# EAGLE schematic pa_only_1800 (EAGLE 6.2)

## Sheet 1 of 4
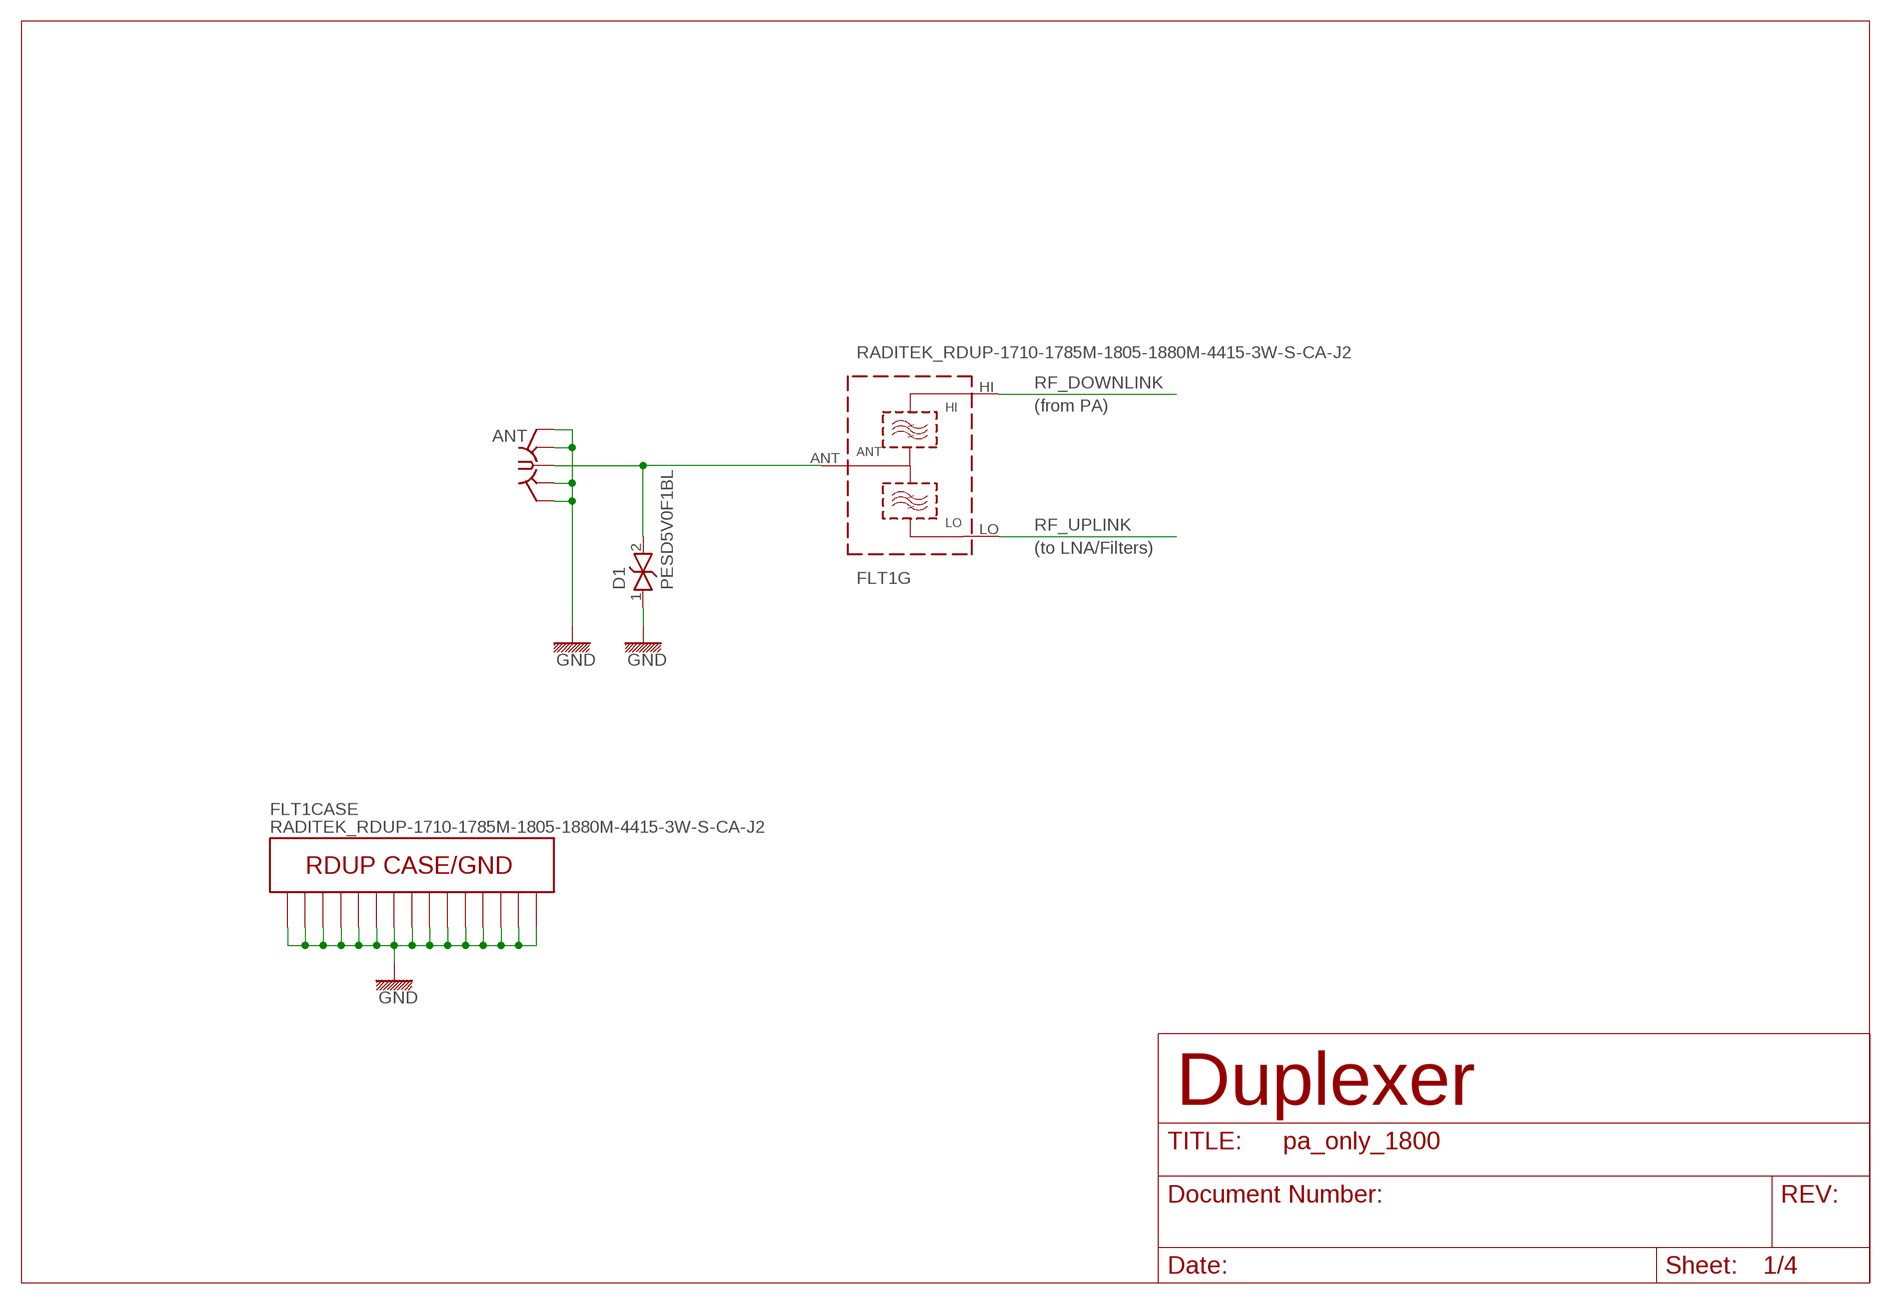
[diagram p0: schematic, sheet 1]

### Parts
ANT  SMA-F-S-TH  [SMA-F-S-TH]
D1  PESD5V0F1BL  D_ESD_SOD882  [SOD882]
FLT1  RADITEK_RDUP-1710-1785M-1805-1880M-4415-3W-S-CA-J2  [RADITEK_RDUP_4415]

### Nets
GND: ANT.G1(GND) ANT.G2(GND) ANT.G3(GND) ANT.G4(GND) D1.1 FLT1.GND@1(CASE:GND) FLT1.GND@2(CASE:GND) FLT1.GND@3(CASE:GND) FLT1.GND@4(CASE:GND) FLT1.GND@5(CASE:GND) FLT1.GND@6(CASE:GND) FLT1.GND@7(CASE:GND) FLT1.GND@8(CASE:GND) FLT1.GND@9(CASE:GND) FLT1.GND@10(CASE:GND) FLT1.GND@11(CASE:GND) FLT1.GND@12(CASE:GND) FLT1.GND@13(CASE:GND) FLT1.GND@14(CASE:GND) FLT1.GND@15(CASE:GND) ; also sheet 2,3,4
RF_ANT: ANT.C D1.2 FLT1.ANT(G:ANT)
RF_DOWNLINK: FLT1.HI(G:HI) ; also sheet 3
RF_UPLINK: FLT1.LO(G:LO) ; also sheet 2

### Notes on the sheet
- (from PA)
- (to LNA/Filters)
- Duplexer

## Sheet 2 of 4
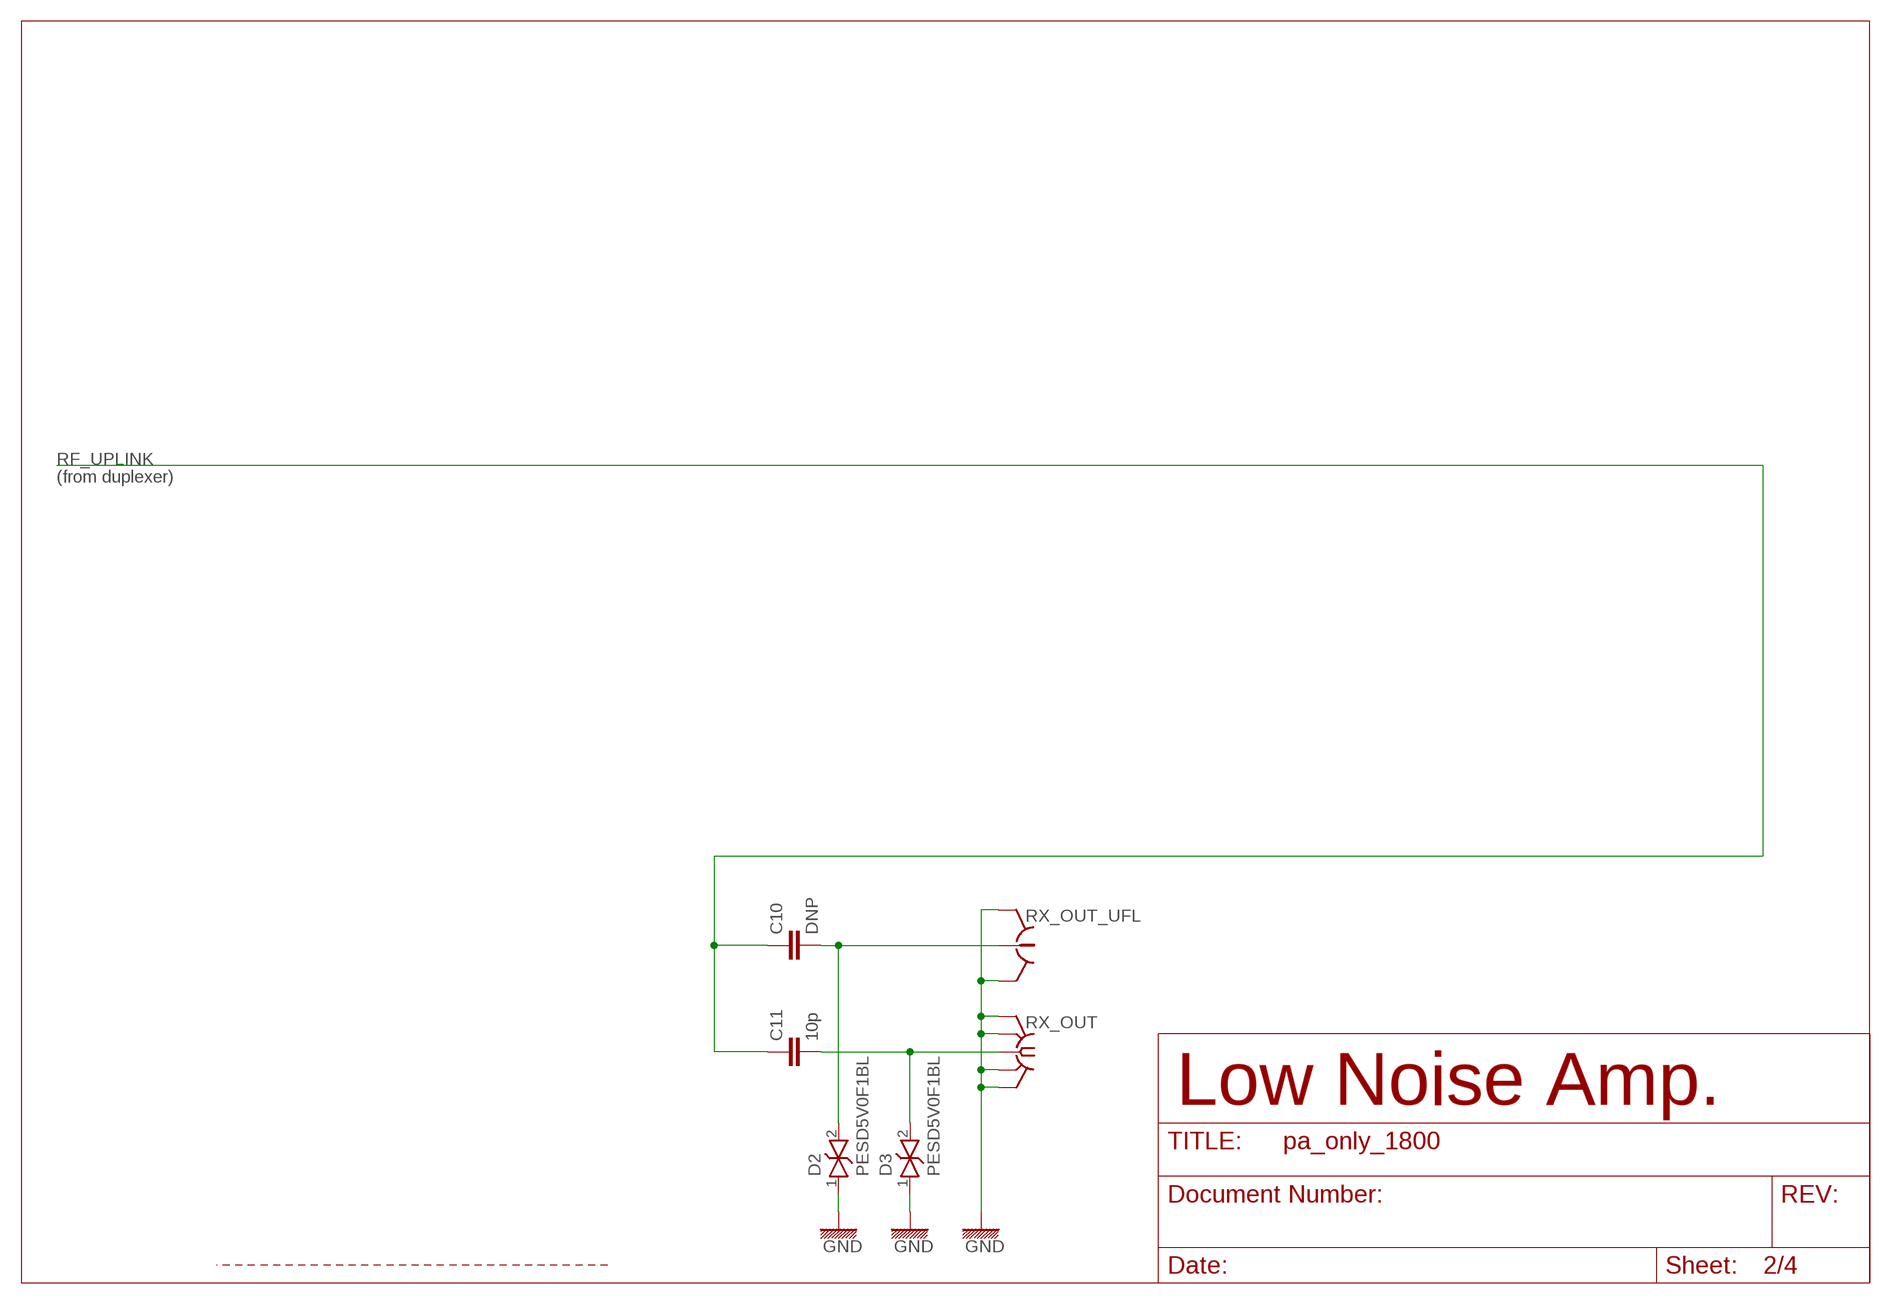
[diagram p1: schematic, sheet 2]

### Parts
C10  DNP  C-EU_0603  [0603]
C11  10p  C-EU_0603  [0603]
D2  PESD5V0F1BL  D_ESD_SOD882  [SOD882]
D3  PESD5V0F1BL  D_ESD_SOD882  [SOD882]
RX_OUT  SMA-F-S-TH  [SMA-F-S-TH]
RX_OUT_UFL  HRS_UFL  [HRS_UFL]

### Nets
GND: D2.1 D3.1 RX_OUT.G1(GND) RX_OUT.G2(GND) RX_OUT.G3(GND) RX_OUT.G4(GND) RX_OUT_UFL.GND@1(GND) RX_OUT_UFL.GND@2(GND) ; also sheet 1,3,4
N$8: C10.2 D2.2 RX_OUT_UFL.SIG
RF_UPLINK: C10.1 C11.1 ; also sheet 1
RF_UPLINK_OUT: C11.2 D3.2 RX_OUT.C

### Notes on the sheet
- (from duplexer)
- Low Noise Amp.

## Sheet 3 of 4
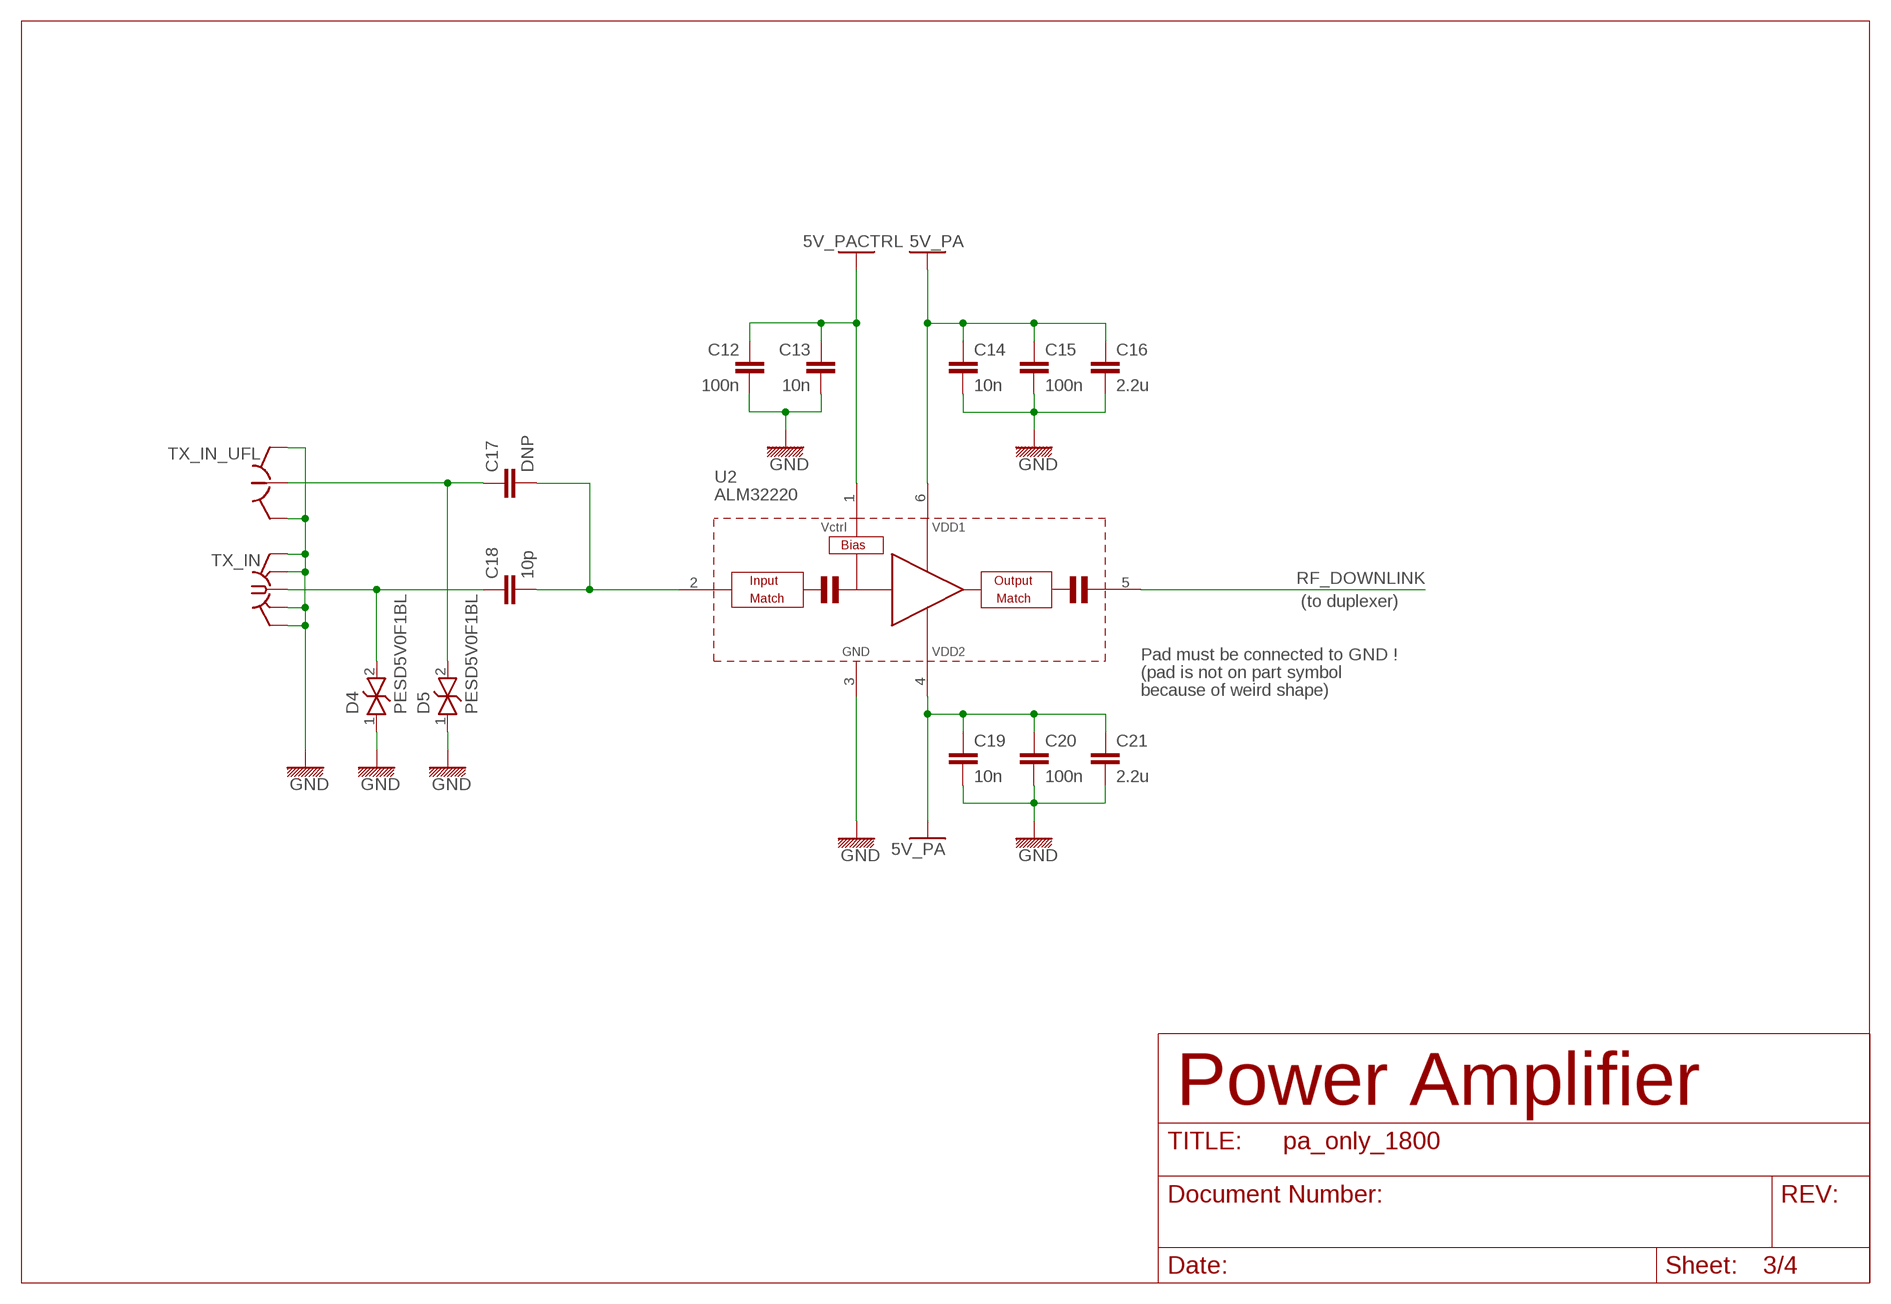
[diagram p2: schematic, sheet 3]

### Parts
C12  100n  C-EU_0603  [0603]
C13  10n  C-EU_0603  [0603]
C14  10n  C-EU_0603  [0603]
C15  100n  C-EU_0603  [0603]
C16  2.2u  C-EU_0805  [0805]
C17  DNP  C-EU_0603  [0603]
C18  10p  C-EU_0603  [0603]
C19  10n  C-EU_0603  [0603]
C20  100n  C-EU_0603  [0603]
C21  2.2u  C-EU_0805  [0805]
D4  PESD5V0F1BL  D_ESD_SOD882  [SOD882]
D5  PESD5V0F1BL  D_ESD_SOD882  [SOD882]
TX_IN  SMA-F-S-TH  [SMA-F-S-TH]
TX_IN_UFL  HRS_UFL  [HRS_UFL]
U2  ALM32220  [ALM32X20]

### Nets
5V_PA: C14.1 C15.1 C16.1 C19.1 C20.1 C21.1 U2.4(VDD2) U2.6(VDD1) ; also sheet 4
5V_PACTRL: C12.1 C13.1 U2.1(VCTRL) ; also sheet 4
GND: C12.2 C13.2 C14.2 C15.2 C16.2 C19.2 C20.2 C21.2 D4.1 D5.1 TX_IN.G1(GND) TX_IN.G2(GND) TX_IN.G3(GND) TX_IN.G4(GND) TX_IN_UFL.GND@1(GND) TX_IN_UFL.GND@2(GND) U2.3(GND) ; also sheet 1,2,4
N$2: C18.1 D4.2 TX_IN.C
N$3: C17.2 C18.2 U2.2(RF_IN)
N$14: C17.1 D5.2 TX_IN_UFL.SIG
RF_DOWNLINK: U2.5(RF_OUT) ; also sheet 1

### Notes on the sheet
- (to duplexer)
- Pad must be connected to GND !
- (pad is not on part symbol
- because of weird shape)
- Power Amplifier

## Sheet 4 of 4
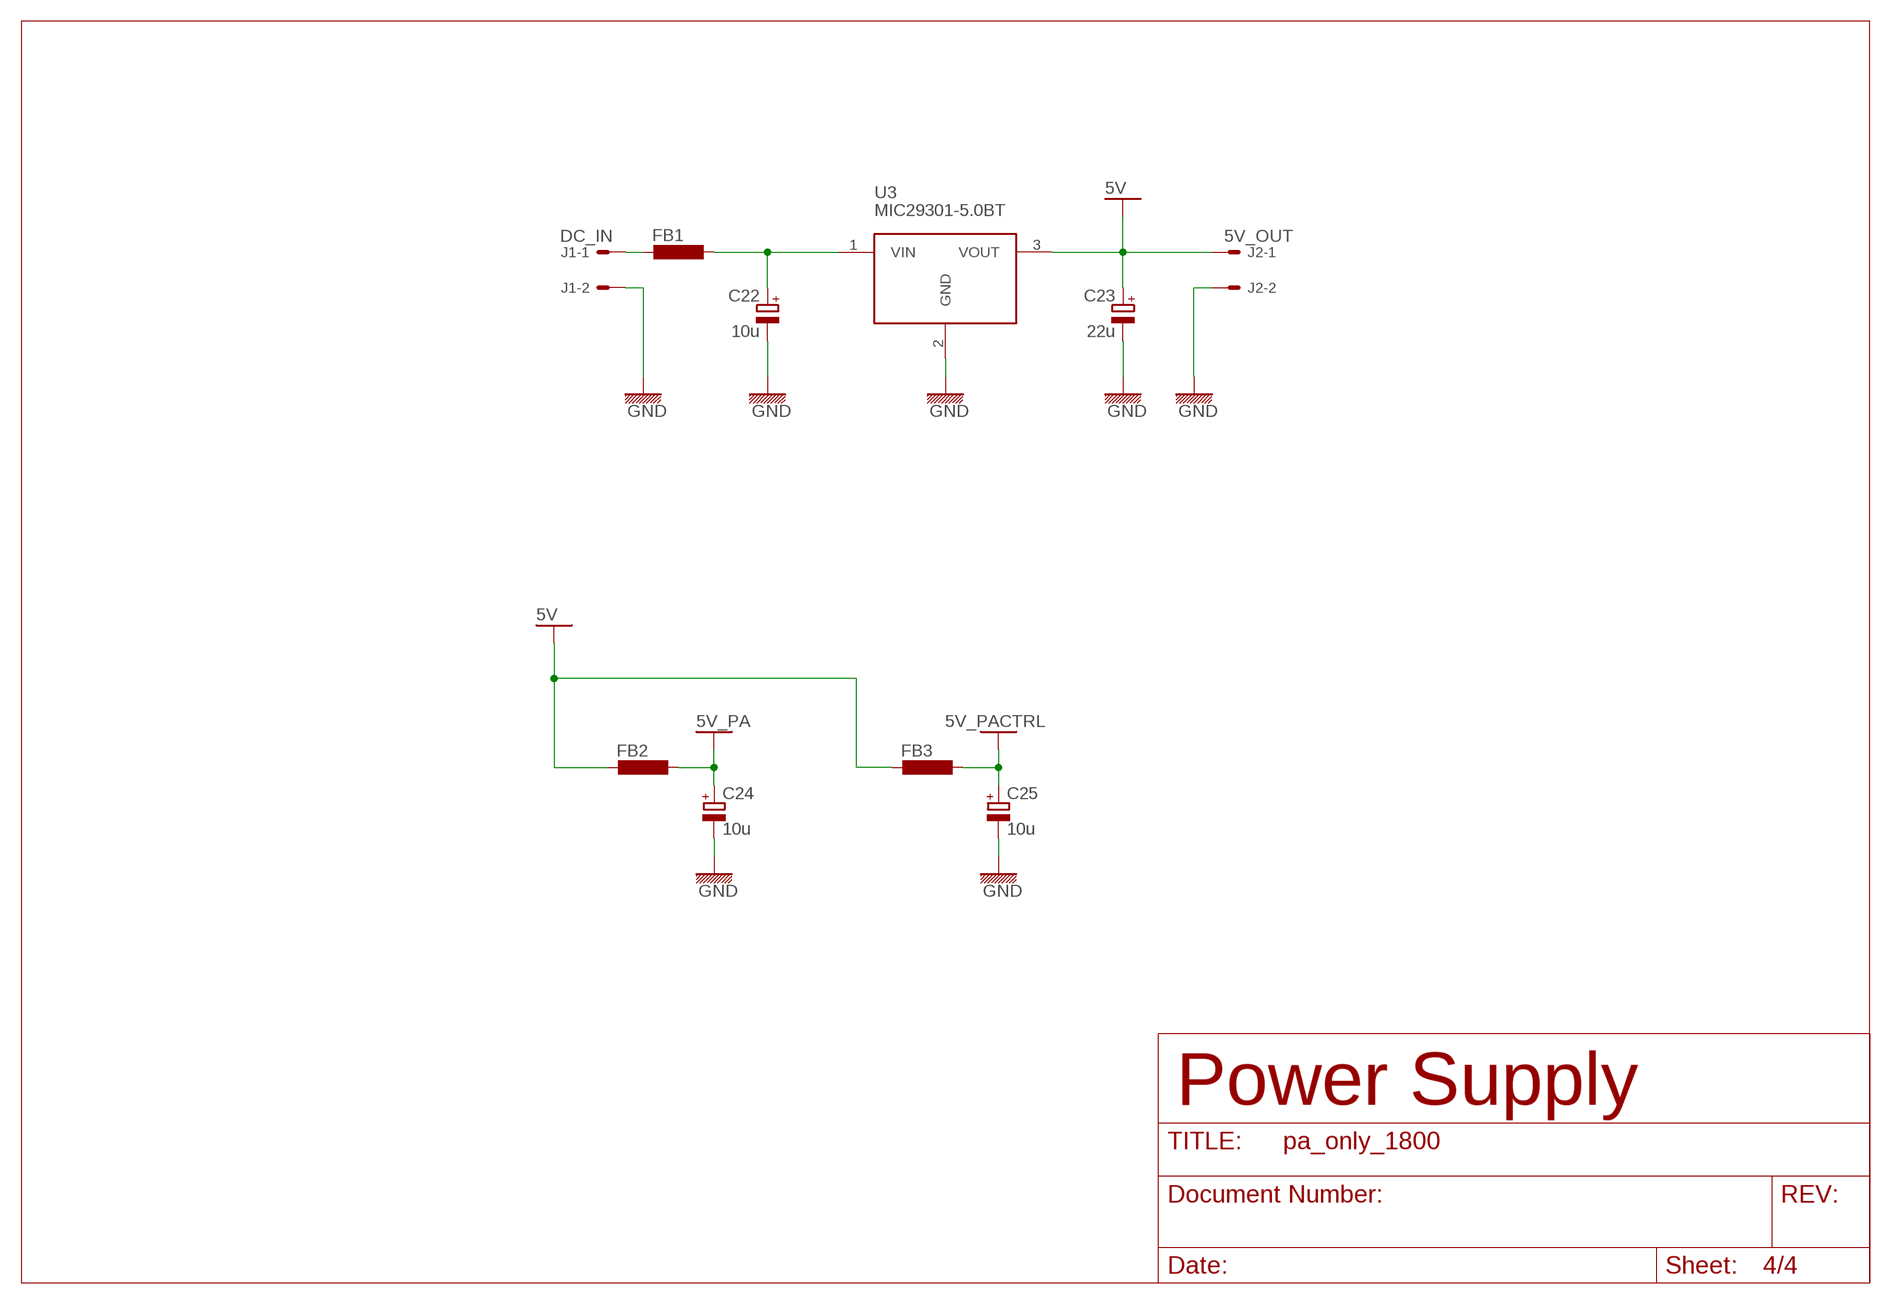
[diagram p3: schematic, sheet 4]

### Parts
C22  10u  CPOL-EUSMCA  [SMC_A]
C23  22u  CPOL-EUSMCA  [SMC_A]
C24  10u  CPOL-EUSMCA  [SMC_A]
C25  10u  CPOL-EUSMCA  [SMC_A]
FB1  FBEAD_1206  [1206]
FB2  FBEAD_1206  [1206]
FB3  FBEAD_0603  [0603]
J1  DC_IN  22-27-2021-02  [6410-02]
J2  5V_OUT  22-27-2021-02  [6410-02]
U3  MIC29301-5.0BT  MIC29XXX-FIX_WT_TO220BV  [TO220BV]

### Nets
5V: C23.+ FB2.1 FB3.1 J2.1 U3.3(VOUT)
5V_PA: C24.+ FB2.2 ; also sheet 3
5V_PACTRL: C25.+ FB3.2 ; also sheet 3
DC_IN: FB1.1 J1.1
DC_IN_FLT: C22.+ FB1.2 U3.1(VIN)
GND: C22.- C23.- C24.- C25.- J1.2 J2.2 U3.2(GND) ; also sheet 1,2,3

### Notes on the sheet
- Power Supply

## Library data of the parts
ANT RX_OUT TX_IN = we_conn:SMA-F
C10-C21 = we_passive:C-EU: Capacitor
C22-C25 = rcl:CPOL-EU: POLARIZED CAPACITOR, European symbol
D1-D5 = we_passive:D_ESD: Diode for ESD Protection Transient suppressors
FB1-FB3 = we_passive:FBEAD: INDUCTOR SMD Bead inductor
FLT1 = we_passive:RADITEK_RDUP-1710-1785M-1805-1880M-4415-3W-S-CA-J2
J1 J2 = con-molex:22-?-02: CONNECTOR wire to board 2.54 mm (.1 inch) pitch header; OC_FARNELL: unknown; OC_NEWARK: unknown
RX_OUT_UFL TX_IN_UFL = we_conn:HRS_UFL: Hirose U.FL SMT
U2 = we_chips:ALM32220
U3 = we_chips:MIC29XXX-FIX: Micrel MIC29xxx series (fixed output versions)